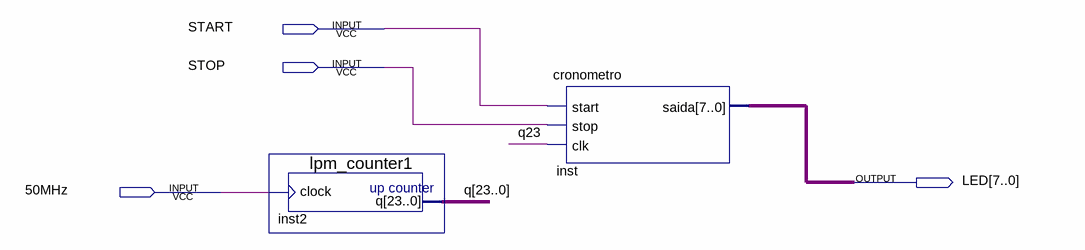
[diagram p0: schematic sheet]
// Quartus schematic Divisor_Frequencia.bdf as structural Verilog: 2 symbols, 4 pins
module Divisor_Frequencia (
  input  START,
  input  STOP,
  input  \50MHz ,
  output [7:0] LED
);

  wire [23:0] q;

  lpm_counter1 inst2 (.clock(\50MHz ), .q(q));
  cronometro inst (.start(START), .stop(STOP), .clk(q[23]), .saida(LED));
endmodule
